# Altium project PMOD_Shifter_3v3_to_1v8.PrjPcb
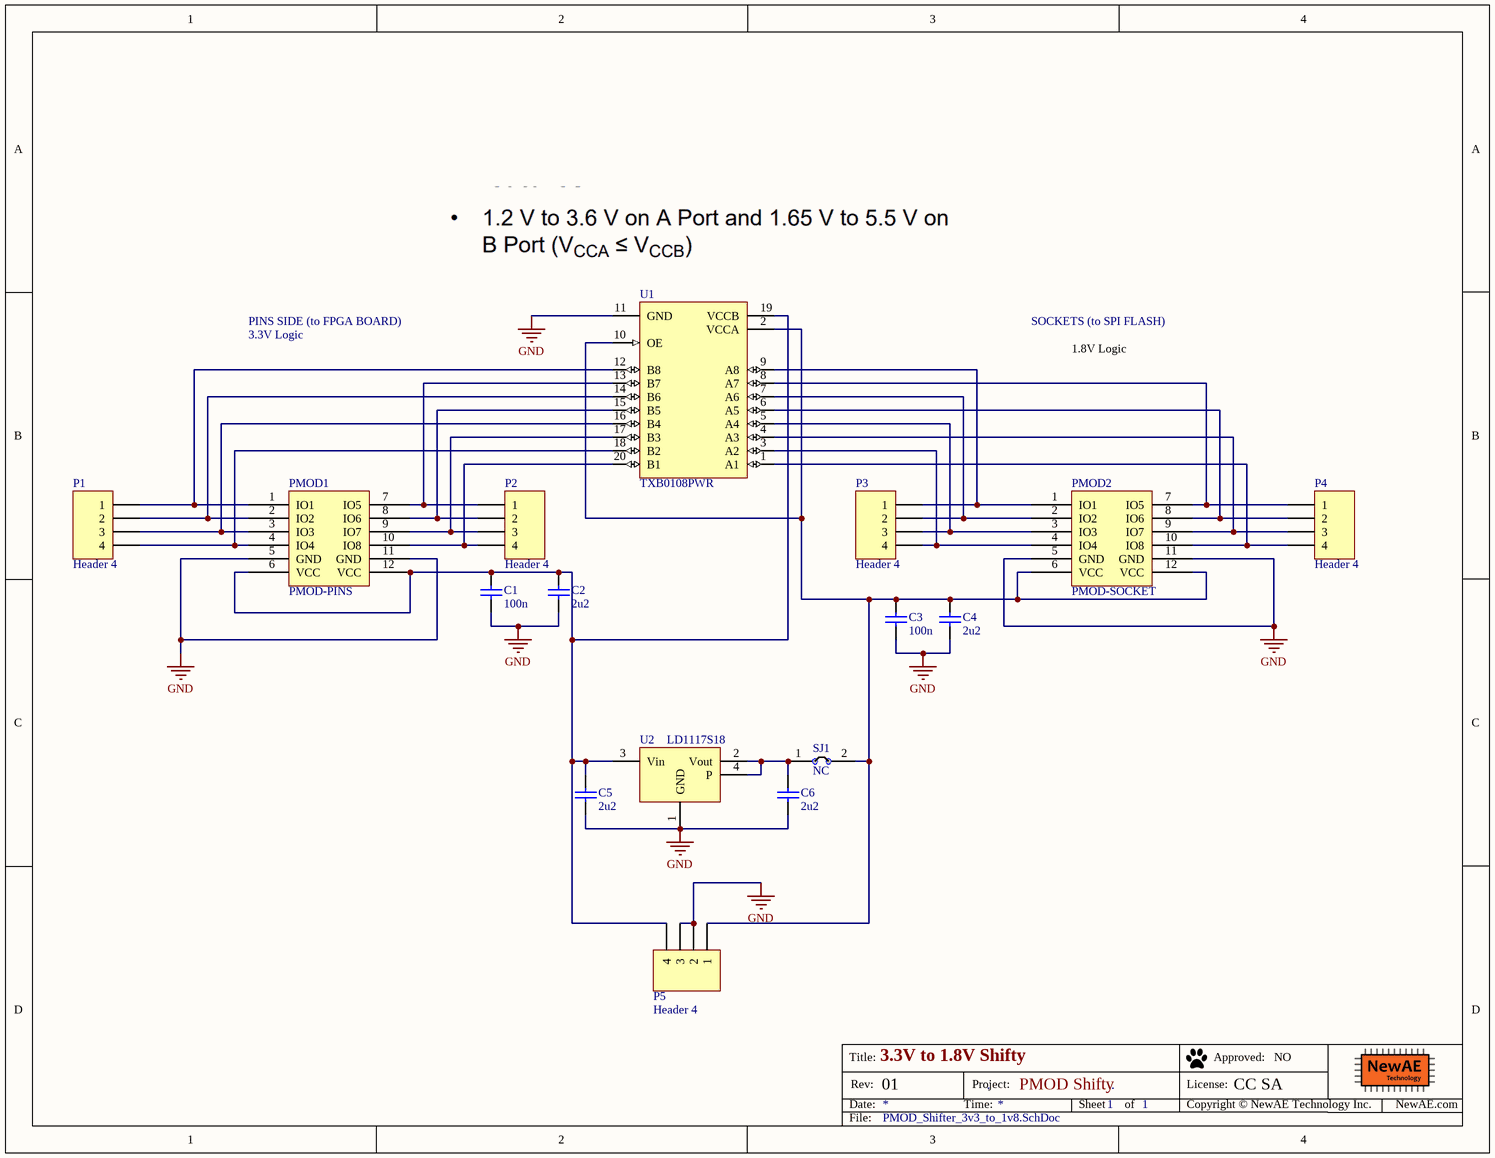
[diagram p0: PMOD_Shifter_3v3_to_1v8.SchDoc]
PrjRev: 01; PrjName: PMOD Shifty; PrjLicense: CC SA
1 sheet, 16 parts. Net scope: global (net labels, ports and power ports of the same name join across sheets).
Board file: PMOD_Shifter_PCB_to1v8.PcbDoc

## Sheet PMOD_Shifter_3v3_to_1v8.SchDoc: 3.3V to 1.8V Shifty
size Letter; Organization: NewAE Technology Inc.; Address1: 1083 Queen St., Suite 196; Address2: Halifax; Address3: NS; Address4: Canada B3H 0B2; DocumentNumber: .; Revision: .; SheetNumber: 1; SheetTotal: 1; SheetApproved: NO

### Parts
C1  100n  [CAPC0603_M]
C2  2u2  [CAPC0603_M]
C3  100n  [CAPC0603_M]
C4  2u2  [CAPC0603_M]
C5  2u2  [CAPC0603_M]
C6  2u2  [CAPC0603_M]
P1  Header 4  [HDR1X4]
P2  Header 4  [HDR1X4]
P3  Header 4  [HDR1X4]
P4  Header 4  [HDR1X4]
P5  Header 4  [HDR1X4]
PMOD1  PMOD-PINS  [PMOD-68021-212HLF-MALE]
PMOD2  PMOD-SOCKET  [SAMTEC_SSW_106_02_X_D_RA_PMOD]
SJ1  NC  [SJ_2S_NC]  (no BOM)
U1  TXB0108PWR  [PW0020A_L]
U2  LD1117S18  [SOT-223]

### Nets
GND: C1.2 C2.2 C3.2 C4.2 C5.2 C6.2 P5.2 P5.3 PMOD1.5(GND) PMOD1.11(GND) PMOD2.5(GND) PMOD2.11(GND) U1.11(GND) U2.1(GND)
NetC1_1: C1.1 C2.1 C5.1 P5.4 PMOD1.6(VCC) PMOD1.12(VCC) U1.19(VCCB) U2.3(Vin)
NetC3_1: C3.1 C4.1 P5.1 PMOD2.6(VCC) PMOD2.12(VCC) SJ1.2 U1.2(VCCA) U1.10(OE)
NetC6_1: C6.1 SJ1.1 U2.2(Vout) U2.4(P)
NetP1_1: P1.1 PMOD1.1(IO1) U1.12(B8)
NetP1_2: P1.2 PMOD1.2(IO2) U1.14(B6)
NetP1_3: P1.3 PMOD1.3(IO3) U1.16(B4)
NetP1_4: P1.4 PMOD1.4(IO4) U1.18(B2)
NetP2_1: P2.1 PMOD1.7(IO5) U1.13(B7)
NetP2_2: P2.2 PMOD1.8(IO6) U1.15(B5)
NetP2_3: P2.3 PMOD1.9(IO7) U1.17(B3)
NetP2_4: P2.4 PMOD1.10(IO8) U1.20(B1)
NetP3_1: P3.1 PMOD2.1(IO1) U1.9(A8)
NetP3_2: P3.2 PMOD2.2(IO2) U1.7(A6)
NetP3_3: P3.3 PMOD2.3(IO3) U1.5(A4)
NetP3_4: P3.4 PMOD2.4(IO4) U1.3(A2)
NetP4_1: P4.1 PMOD2.7(IO5) U1.8(A7)
NetP4_2: P4.2 PMOD2.8(IO6) U1.6(A5)
NetP4_3: P4.3 PMOD2.9(IO7) U1.4(A3)
NetP4_4: P4.4 PMOD2.10(IO8) U1.1(A1)

### Notes on the sheet
- PINS SIDE (to FPGA BOARD)
- 3.3V Logic
- SOCKETS (to SPI FLASH)
- 1.8V Logic
- Title:
- Date:
- Rev:
- Time:
- Project:
- Sheet
- of
- License:
- Copyright © NewAE Technology Inc.
- Approved:
- NewAE.com
- File:

### Library data of the parts
C1 C3 = CCHIP-100n-0603: 100n, 0603; Manufacture 1: Kemet; Manufacture Part Number 1: C0603C104K5RACTU; Component Group: Capacitor; Case-EIA: 0603; Case-Metric: 1608; Rated Voltage: 50VDC; Part Number: CCHIP-100n-0603; Footprint: 0603; Pin Count: 2; Supplier 1: Digi-Key; Supplier Part Number 1: 399-5089-2-ND; Value: 100n; Mounting Technology: SMT; Component Kind: Standard; Component Type: Standard
C2 C4-C6 = CCHIP-2u2-0603: 2u2, 0603; Manufacture 1: Samsung; Manufacture Part Number 1: CL10B225KP8NNNC; Component Group: Capacitor; Case-EIA: 0603; Case-Metric: 1608; Rated Voltage: 10VDC; Part Number: CCHIP-2u2-0603; Footprint: 0603; Pin Count: 2; Supplier 1: Digi-Key; Supplier Part Number 1: 1276-1134-1-ND; Value: 2u2; Mounting Technology: SMT; Component Kind: Standard; Component Type: Standard
P1-P5 = Header 4: Header, 4-Pin; LatestRevisionDate: 17-Jul-2002; LatestRevisionNote: Re-released for DXP Platform.; Publisher: Altium Limited
PMOD1 = PMOD_2ROW_MALERATH: Component Group: Connector; PP Material Stack: 0; Part Number: PMOD_2ROW_MALERATH; Pin Count: 12; Supplier 1: Digi-Key; Component Kind: Standard; Component Type: Standard; PP Rotation: 0; PP Rotation1: 0
PMOD2 = PMOD_2ROW_FEMALERATH: Component Group: Connector; PP Material Stack: 0; Part Number: PMOD_2ROW_FEMALERATH; Pin Count: 12; Supplier 1: Digi-Key; Supplier Part Number 1: SAM1215-06-ND; Component Kind: Standard; Component Type: Standard; PP Rotation: 0; PP Rotation1: 0
SJ1 = SJ_2S: Solder Jumper, NC; Component Group: PCB Feature; Part Number: SJ_2S; Pin Count: 2; Mounting Technology: COPPER; Component Type: Standard (No BOM)
U1 = CMP-2000-07337-1: TXB0108 8-Bit Bidirectional Voltage-Level Translator with Auto-Direction Sensing and / +/- 15-kV ESD Protection, 1.2 to 3.6 V, -40 to 85 degC, 20-Pin TSSOP (PW), Green (RoHS & no Sb/Br), Tape and Reel; Manufacturer: Texas Instruments; Propagation Delay (Max): 4ns; Logic Function: Translator,Bidirectional; Input Type: Logic; Package Version: 4040064-5/G, 02/2011; Voltage - Supply: 1.2V~3.6V,1.65V~5.5V; Data Rate: 100Mbps; Other Names: 296-21527-6; Number of Channels: 8; Differential - Input: Output:No/No; Number of Outputs/Channel: 1; Product Training Modules: VoltageLevelTranslation; Dynamic Catalog: TXBSeries; Package Reference: PW20; Package Description: 20-Pin Small Outline Package Integrated Circuit, Body 6.5 x 4.4 mm, Pitch 0.65 mm; Category: IntegratedCircuits(ICs); Datasheet URL: http://www.ti.com/general/docs/lit/getliterature.tsp?genericPartNumber=TXB0108&fileType=pdf; Package / Case: 20-TSSOP(0.173",4.40mmWidth); Family: Logic-Translators; Standard Package: 1; Series: -; Manufacturer URL: http://www.ti.com/; Number of Bits: 8; Package URL: http://www.ti.com/litv/pdf/mpds362; Output Type: Logic; Datasheet Version: Rev. F, 12/2014; Packaging: Digi-Reel®; Operating Temperature: -40°C~85°C; Supplier Device Package: 20-TSSOP; Mounting Technology: SurfaceMount
U2 = LD1117S18: IC REG LIN POS 1.8V 800MA SOT223; Manufacture 1: STMicroelectronics; Manufacture Part Number 1: LD1117S18TR; Component Group: Analog IC; Rated Voltage: 15V; PP Material Stack: 0; Part Number: LD1117S18; Pin Count: 3; Supplier 1: Digi-Key; Supplier Part Number 1: 497-7308-1-ND; Mounting Technology: SMT; RoHS: Yes; Component Kind: Standard; Component Type: Standard; PP Rotation: 0